# EAGLE schematic chcp_schematic (EAGLE 7.1.0)
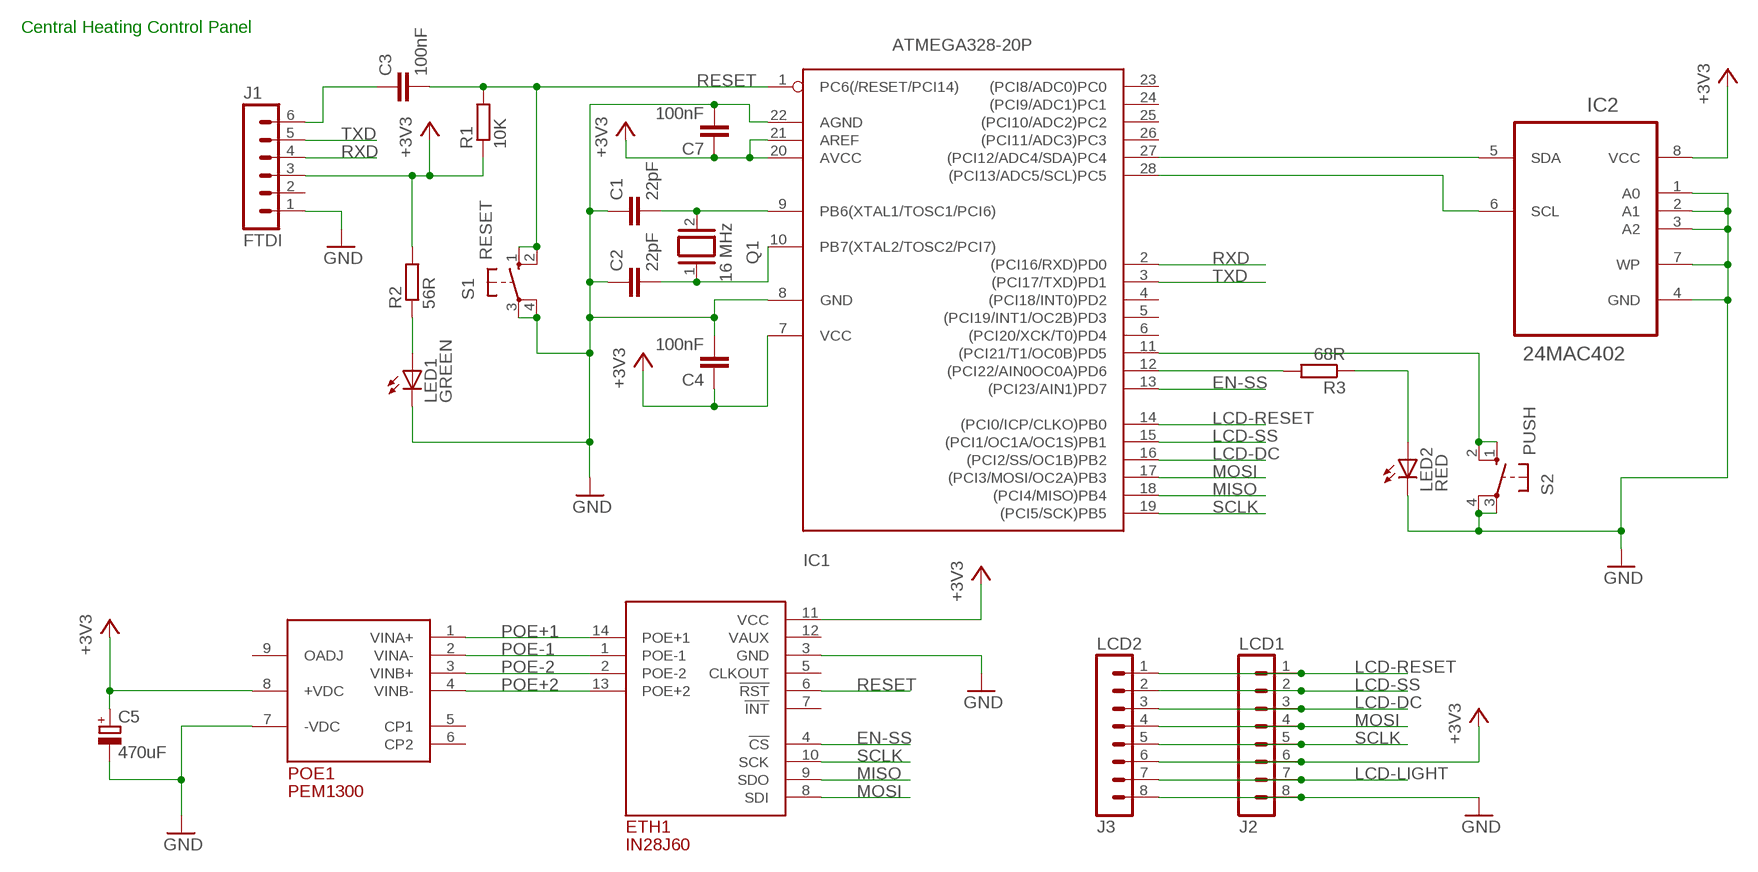
[diagram p0: schematic, sheet 1]

## Parts
C1  22pF  C-EU025-024X044  [C025-024X044]
C2  22pF  C-EU025-024X044  [C025-024X044]
C3  100nF  C-EU025-024X044  [C025-024X044]
C4  100nF  C-EU025-024X044  [C025-024X044]
C5  470uF  CPOL-EUE2.5-5  [E2,5-5]
C7  100nF  C-EU025-024X044  [C025-024X044]
ETH1  IN28J60  [DIL]
IC1  ATMEGA328-20P  [DIL28-3]
IC2  24MAC402  24MAC402-SSHM-TPDIP  [PDIP]
J1  FTDI  MA06-1  [MA06-1]
J2  LCD1  MA08-1  [MA08-1]
J3  LCD2  MA08-1  [MA08-1]
LED1  GREEN  LED3MM  [LED3MM]
LED2  RED  LED3MM  [LED3MM]
POE1  PEM1300  [SIL]
Q1  16 MHz  XTAL/S  [QS]
R1  10K  R-EU_0204/7  [0204/7]
R2  56R  R-EU_0204/7  [0204/7]
R3  68R  R-EU_0204/7  [0204/7]
S1  RESET  10-XX  [B3F-10XX]
S2  PUSH  10-XX  [B3F-10XX]

## Nets
+3V3: C4.1 C5.+ C7.1 ETH1.11(VCC) IC1.7(VCC) IC1.20(AVCC) IC1.21(AREF) IC2.8(VCC) J1.3 J2.6 J3.6 POE1.8(+VDC) R1.1 R2.2
EN-SS: ETH1.4(!CS!) IC1.13((PCI23/AIN1)PD7)
GND: C1.1 C2.1 C4.2 C5.- C7.2 ETH1.3(GND) IC1.8(GND) IC1.22(AGND) IC2.1(A0) IC2.2(A1) IC2.3(A2) IC2.4(GND) IC2.7(WP) J1.1 J2.8 J3.8 LED1.K(C) LED2.K(C) POE1.7(-VDC) S1.3(P) S1.4(P1) S2.3(P) S2.4(P1)
LCD-DC: IC1.16((PCI2/SS/OC1B)PB2) J2.3 J3.3
LCD-LIGHT: J2.7 J3.7
LCD-RESET: IC1.14((PCI0/ICP/CLKO)PB0) J2.1 J3.1
LCD-SS: IC1.15((PCI1/OC1A/OC1S)PB1) J2.2 J3.2
MISO: ETH1.9(SDO) IC1.18((PCI4/MISO)PB4)
MOSI: ETH1.8(SDI) IC1.17((PCI3/MOSI/OC2A)PB3) J2.4 J3.4
N$1: C2.2 IC1.10(PB7(XTAL2/TOSC2/PCI7)) Q1.1
N$2: IC1.27((PCI12/ADC4/SDA)PC4) IC2.5(SDA)
N$3: IC1.28((PCI13/ADC5/SCL)PC5) IC2.6(SCL)
N$5: C3.1 J1.6
N$6: C1.2 IC1.9(PB6(XTAL1/TOSC1/PCI6)) Q1.2
N$8: LED1.A R2.1
N$10: LED2.A R3.1
N$11: IC1.12((PCI22/AIN0OC0A)PD6) R3.2
N$13: IC1.11((PCI21/T1/OC0B)PD5) S2.1(S) S2.2(S1)
POE+1: ETH1.14(POE+1) POE1.1(VINA+)
POE+2: ETH1.13(POE+2) POE1.4(VINB-)
POE-1: ETH1.1(POE-1) POE1.2(VINA-)
POE-2: ETH1.2(POE-2) POE1.3(VINB+)
RESET: C3.2 ETH1.6(!RST!) IC1.1(PC6(/RESET/PCI14)) R1.2 S1.1(S) S1.2(S1)
RXD: IC1.2((PCI16/RXD)PD0) J1.4
SCLK: ETH1.10(SCK) IC1.19((PCI5/SCK)PB5) J2.5 J3.5
TXD: IC1.3((PCI17/TXD)PD1) J1.5
Unconnected: ETH1.5(CLKOUT) ETH1.7(!INT!) ETH1.12(VAUX) IC1.4((PCI18/INT0)PD2) IC1.5((PCI19/INT1/OC2B)PD3) IC1.6((PCI20/XCK/T0)PD4) IC1.23((PCI8/ADC0)PC0) IC1.24((PCI9/ADC1)PC1) IC1.25((PCI10/ADC2)PC2) IC1.26((PCI11/ADC3)PC3) J1.2 POE1.5(CP1) POE1.6(CP2) POE1.9(OADJ)

## Notes on the sheet
- Central Heating Control Panel

## Library data of the parts
C1-C4 C7 = rcl:C-EU: CAPACITOR, European symbol
C5 = rcl:CPOL-EU: POLARIZED CAPACITOR, European symbol
ETH1 = in28j60:IN28J60: Stand-alone Ethernet Controller Module
IC1 = atmega328:ATMEGA328*P: MICROCONTROLLER 32 kBytes FLASH 2 kBytes SRAM 1 kBytes EEPROM USART 8-channel 10 bit ADC
IC2 = at24mac402:24MAC402-SSHM-T: EEPROM, SERIAL, 2KB, 48-BIT MAC, 8SOIC
J1 = con-lstb:MA06-1: PIN HEADER; OC_FARNELL: unknown; OC_NEWARK: unknown
J2 J3 = con-lstb:MA08-1: PIN HEADER; OC_FARNELL: unknown; OC_NEWARK: unknown
LED1 LED2 = led:LED: LED OSRAM: - CHIPLED LG R971, LG N971, LY N971, LG Q971, LY Q971, LO R971, LY R971 LH N974, LH R974 LS Q976, LO Q976, LY Q976 LO Q996 - Hyper CHIPLED LW Q18S LB Q993, LB Q99A, LB R99A - SideLED LS A670, LO A670, LY A670, LG A670, LP A670 LB A673, LV A673, LT A673, LW A673 LH A674 LY A675 LS A676, LA A676, LO A676, LY A676, LW A676 LS A679, LY A679, LG A679 - Hyper Micro SIDELED® LS Y876, LA Y876, LO Y876, LY Y876 LT Y87S - SmartLED LW L88C, LW L88S LB L89C, LB L89S, LG L890 LS L89K, LO L89K, LY L89K LS L896, LA L896, LO L896, LY L896 - TOPLED LS T670, LO T670, LY T670, LG T670, LP T670 LSG T670, LSP T670, LSY T670, LOP T670, LYG T670 LG T671, LOG T671, LSG T671 LB T673, LV T673, LT T673, LW T673 LH T674 LS T676, LA T676, LO T676, LY T676, LB T676, LH T676, LSB T676, LW T676 LB T67C, LV T67C, LT T67C, LS T67K, LO T67K, LY T67K, LW E67C LS E67B, LA E67B, LO E67B, LY E67B, LB E67C, LV E67C, LT E67C LW T67C LS T679, LY T679, LG T679 LS T770, LO T770, LY T770, LG T770, LP T770 LB T773, LV T773, LT T773, LW T773 LH T774 LS E675, LA E675, LY E675, LS T675 LS T776, LA T776, LO T776, LY T776, LB T776 LHGB T686 LT T68C, LB T68C - Hyper Mini TOPLED® LB M676 - Mini TOPLED Santana® LG M470 LS M47K, LO M47K, LY M47K Source: http://www.osram.convergy.de LUXEON: - LUMILED® LXK2-PW12-R00, LXK2-PW12-S00, LXK2-PW14-U00, LXK2-PW14-V00 LXK2-PM12-R00, LXK2-PM12-S00, LXK2-PM14-U00 LXK2-PE12-Q00, LXK2-PE12-R00, LXK2-PE12-S00, LXK2-PE14-T00, LXK2-PE14-U00 LXK2-PB12-K00, LXK2-PB12-L00, LXK2-PB12-M00, LXK2-PB14-N00, LXK2-PB14-P00, LXK2-PB14-Q00 LXK2-PR12-L00, LXK2-PR12-M00, LXK2-PR14-Q00, LXK2-PR14-R00 LXK2-PD12-Q00, LXK2-PD12-R00, LXK2-PD12-S00 LXK2-PH12-R00, LXK2-PH12-S00 LXK2-PL12-P00, LXK2-PL12-Q00, LXK2-PL12-R00 Source: www.luxeon.com KINGBRIGHT: KA-3528ASYC Source: www.kingbright.com
POE1 = pem1300:PEM1300: Power Over Ethernet PD Module; MPN: PEM1303; OC_FARNELL: 1902523
Q1 = special:XTAL/S: CRYSTAL
R1-R3 = rcl:R-EU_: RESISTOR, European symbol
S1 S2 = switch-omron:10-XX: OMRON SWITCH; MPN: B3F-1000; OC_FARNELL: 176432; OC_NEWARK: 36M3542